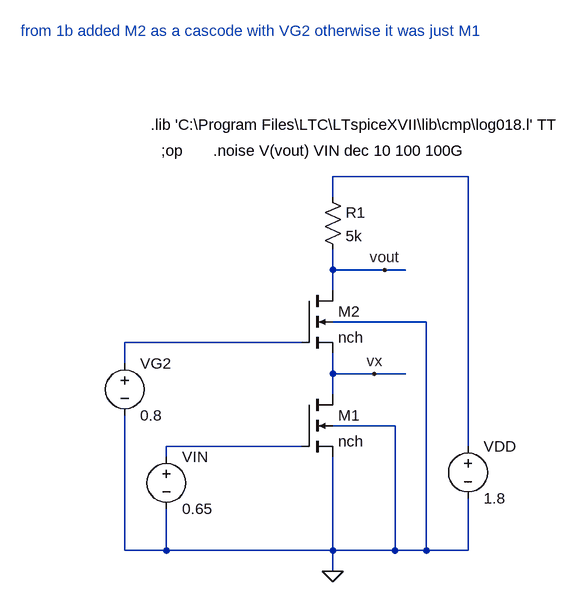
[diagram p0: schematic Week6_Ex1.asc]
Week6_Ex1.asc, the LTspice schematic file:
Version 4
SHEET 1 880 680
WIRE 416 0 208 0
WIRE 208 32 208 0
WIRE 208 144 208 112
WIRE 288 144 208 144
WIRE 320 144 288 144
WIRE 208 176 208 144
WIRE 352 224 208 224
WIRE 160 256 -112 256
WIRE -112 288 -112 256
WIRE 208 304 208 272
WIRE 272 304 208 304
WIRE 320 304 272 304
WIRE 208 336 208 304
WIRE 304 384 208 384
WIRE 160 416 -48 416
WIRE 416 416 416 0
WIRE -48 432 -48 416
WIRE -112 576 -112 368
WIRE -48 576 -48 512
WIRE -48 576 -112 576
WIRE 208 576 208 432
WIRE 208 576 -48 576
WIRE 304 576 304 384
WIRE 304 576 208 576
WIRE 352 576 352 224
WIRE 352 576 304 576
WIRE 416 576 416 496
WIRE 416 576 352 576
WIRE 208 608 208 576
FLAG 208 608 0
FLAG 272 304 vx
FLAG 288 144 vout
SYMBOL nmos4 160 336 R0
SYMATTR InstName M1
SYMATTR Value nch
SYMATTR Value2 l=1u w=20u
SYMBOL voltage -48 416 R0
WINDOW 123 0 0 Left 0
WINDOW 39 0 0 Left 0
SYMATTR InstName VIN
SYMATTR Value 0.65
SYMBOL voltage 416 400 R0
WINDOW 123 0 0 Left 0
WINDOW 39 0 0 Left 0
SYMATTR InstName VDD
SYMATTR Value 1.8
SYMBOL res 192 16 R0
SYMATTR InstName R1
SYMATTR Value 5k
SYMBOL nmos4 160 176 R0
SYMATTR InstName M2
SYMATTR Value nch
SYMATTR Value2 l=1u w=20u
SYMBOL voltage -112 272 R0
WINDOW 123 0 0 Left 0
WINDOW 39 0 0 Left 0
SYMATTR InstName VG2
SYMATTR Value 0.8
TEXT -72 -80 Left 2 !.lib 'C:\\Program Files\\LTC\\LTspiceXVII\\lib\\cmp\\log018.l' TT
TEXT -56 -40 Left 2 !;op
TEXT 24 -40 Left 2 !.noise V(vout) VIN dec 10 100 100G
TEXT -272 -224 Left 2 ;from 1b added M2 as a cascode with VG2 otherwise it was just M1

The netlist it stands for:
* Week6_Ex1.asc
M1 vx N003 0 0 nch l=1u w=20u
VIN N003 0 0.65
VDD N001 0 1.8
R1 N001 vout 5k
M2 vout N002 vx 0 nch l=1u w=20u
VG2 N002 0 0.8
.model NMOS NMOS
.model PMOS PMOS
.lib standard.mos
.lib 'C:\Program Files\LTC\LTspiceXVII\lib\cmp\log018.l' TT
;op
.noise V(vout) VIN dec 10 100 100G
* from 1b added M2 as a cascode with VG2 otherwise it was just M1
.backanno
.end